# Altium schematic sheet buffer.SchDoc
size A
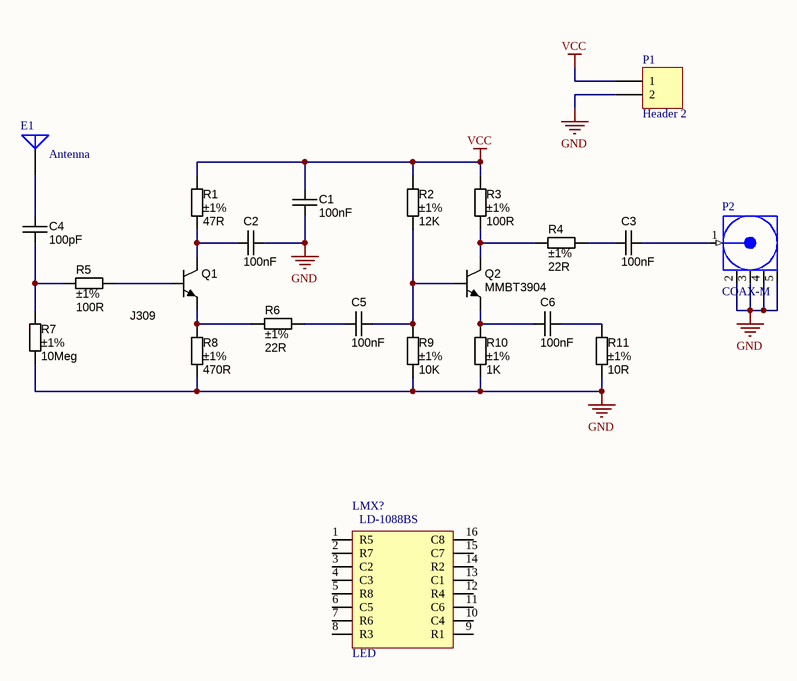
[diagram p0: buffer.SchDoc]

## Parts
C1  100nF  [CAPC2012N]
C2  100nF  [CAPC2012N]
C3  100nF  [CAPC2012N]
C4  100pF  [CAPC2012N]
C5  100nF  [CAPC2012N]
C6  100nF  [CAPC2012N]
E1  Antenna  [PIN1]
LMX?  LED  [MATRIX8x8]
P1  Header 2  [HDR1X2]
P2  COAX-M  [MMCX2.54-V5]
Q1  Manufacturer Part Number 1: J309  [SOT23-3]
Q2  Manufacturer Part Number 1: MMBT3904  [SOT23-3]
R1  Tolerance: ±1%  [RESC2012N]  (hidden comment: 47R)
R2  Tolerance: ±1%  [RESC2012N]  (hidden comment: 12K)
R3  Tolerance: ±1%  [RESC2012N]  (hidden comment: 100R)
R4  Tolerance: ±1%  [RESC2012N]  (hidden comment: 22R)
R5  Tolerance: ±1%  [RESC2012N]  (hidden comment: 100R)
R6  Tolerance: ±1%  [RESC2012N]  (hidden comment: 22R)
R7  Tolerance: ±1%  [RESC2012N]  (hidden comment: 10Meg)
R8  Tolerance: ±1%  [RESC2012N]  (hidden comment: 470R)
R9  Tolerance: ±1%  [RESC2012N]  (hidden comment: 10K)
R10  Tolerance: ±1%  [RESC2012N]  (hidden comment: 1K)
R11  Tolerance: ±1%  [RESC2012N]  (hidden comment: 10R)

## Nets
GND: C1.1 C2.1 P1.2 P2.2(GND) P2.3(GND) P2.4(GND) P2.5(GND) R7.2 R8.2 R9.2 R10.2 R11.2
VCC: C1.2 P1.1 R1.1 R2.1 R3.1
NetC2_2: C2.2 Q1.3(C) R1.2
NetC3_1: C3.1 P2.1(Signal)
NetC3_2: C3.2 R4.1
NetC4_1: C4.1 E1.1(A)
NetC4_2: C4.2 R5.1 R7.1
NetC5_1: C5.1 Q2.1(B) R2.2 R9.1
NetC5_2: C5.2 R6.1
NetC6_1: C6.1 R11.1
NetC6_2: C6.2 Q2.2(E) R10.1
NetQ1_1: Q1.1(B) R5.2
NetQ1_2: Q1.2(E) R6.2 R8.1
NetQ2_3: Q2.3(C) R3.2 R4.2

Not connected (* = marked no-connect by the designer): LMX? 1(R5) 2(R7) 3(C2) 4(C3) 5(R8) 6(C5) 7(R6) 8(R3) 9(R1) 10(C4) 11(C6) 12(R4) 13(C1) 14(R2) 15(C7) 16(C8)

## Library data of the parts
C1-C6 = CAPC_27p_0805_50V: Capacitor SMD Cer 27pF 5% 50V X7R 0805; Manufacturer 1: Panasonic - ECG; Manufacturer Part Number 1: ECJ-2VC1H270J; Ratings: 50V; X7R; Tolerance: ±5%; Operating Temperature: -55°C ~ 125°C; Package / Case: 0805 (2012 metric); Supplier 1: Digi-Key; Supplier Part Number 1: PCC270CGCT-ND
  C1-C3 C5 C6: Value: 100nF
  C4: Value: 100pF
E1 = Antenna: Generic Antenna; Published: 24-Mar-1999; LatestRevisionDate: 17-Jul-2002; LatestRevisionNote: Re-released for DXP Platform.; PackageReference: PIN1; Publisher: Altium Limited
LMX? = MATRIX_8x8: LD-1088BS; Name: LD-1088BS; URL_DATASHEET: http://3.bp.blogspot.com/-BLbR7vREplM/UnuXO4A-2HI/AAAAAAAABlk/y81bJoB9voY/s320/LD-1088BS-t2.jpg
P1 = Header 2: Header, 2-Pin; LatestRevisionDate: 17-Jul-2002; LatestRevisionNote: Re-released for DXP Platform.; Publisher: Altium Limited
P2 = COAX-M: RF Coaxial PCB Connector, MMCX; Thru-Hole, Vertical Mount Plug,  50 Ohm Impedance; PackageDocument: Rev. A, 16-Jun-1997; PCB_Layout: Complies with manufacturer's recommendation.; DrillSize: Corresponds to nominal value.; Published: 15-Jul-2004; LatestRevisionDate: 15-Jul-2004; LatestRevisionNote: Component Replaced.; DatasheetDocument: 30-May-2003; PackageReference: 908-21103; Publisher: Altium Limited; ComponentLink1Description: Manufacturer Link; ComponentLink1URL: http://www.amphenolrf.com/
Q1 Q2 = NPN_MMBT3904: Transistor SMD NPN 40V 0.2A 350mW SOT-23; Manufacturer 1: Fairchild Semiconductor; Ratings: 40V; 200mA; 350mW; Material: Si; Package / Case: SOT-23; Supplier 1: Digi-Key; Supplier Part Number 1: MMBT3904FSCT-ND; Transistor Type: NPN; Mounting Type: Surface Mount
R1-R11 = RES_100R_0805_1%: Resistor SMD chip 100 Ohm 0.125W 1% 0805; Manufacturer 1: Yageo; Manufacturer Part Number 1: RC0805FR-07100RL; Ratings: 1/8 W; Package / Case: 0805 (2012 Metric); Material: Thick Film; Supplier 1: Digi-Key; Supplier Part Number 1: 311-100CRCT-ND
  R1: Value: 47R
  R2: Value: 12K
  R3 R5: Value: 100R
  R4 R6: Value: 22R
  R7: Value: 10Meg
  R8: Value: 470R
  R9: Value: 10K
  R10: Value: 1K
  R11: Value: 10R